# EAGLE design RS232_2xNPN_FTDI_PowerSel (EAGLE 7.7.0)
RS232 Adapter using two NPN Transistors
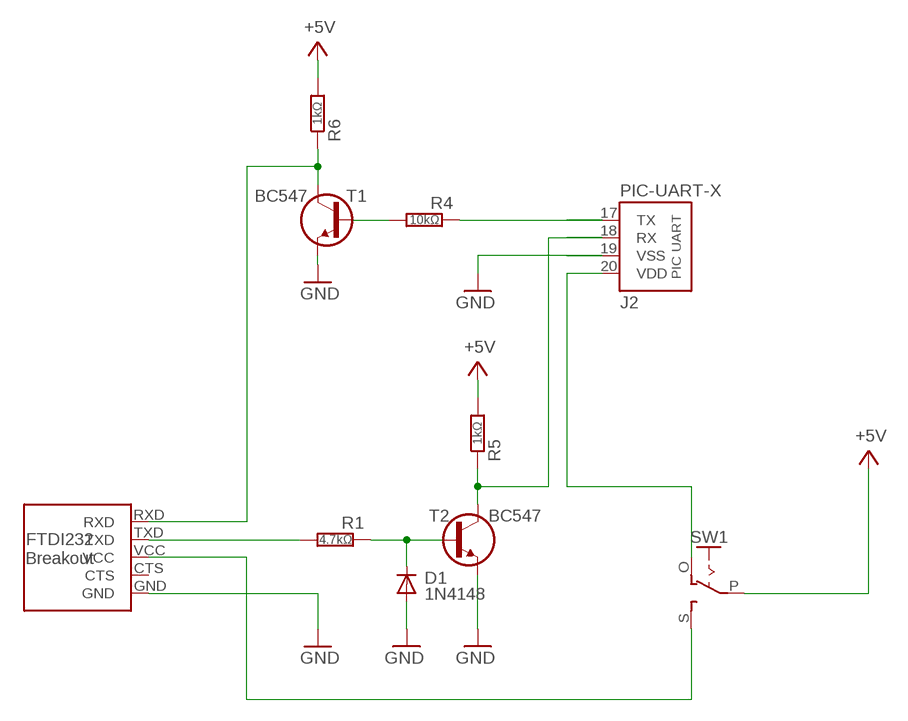
[diagram p0: schematic, sheet 1]

## Parts
D1  1N4148  1N414834-5V  [DO34-5V]
J1  FTDI232-BO-5P-L  [FTDI232-BO-5-L]
J2  PIC-UART-X  [PIC-UART-X]
R1  4.7kΩ  R0202/7  [0202/7]
R4  10kΩ  R0202/7  [0202/7]
R5  1kΩ  R0202/7-V  [0202/7-V]
R6  1kΩ  R0202/7  [0202/7]
SW1  SL-SW-1P-2T-JPSW  [JPSW-1P2T]
T1  BC547  BC547CBE  [TO92-CBE]
T2  BC547  BC547CBE  [TO92-CBE]

## Nets
+5V: R5.2 R6.2 SW1.P
GND: D1.A J1.GND J2.19(VSS) T1.E T2.E
N$1: J2.18(RX) R5.1 T2.C
N$2: D1.C R1.1 T2.B
N$3: J1.TXD R1.2
N$4: J2.17(TX) R4.1
N$5: R4.2 T1.B
N$6: J2.20(VDD) SW1.O
N$8: J1.VCC SW1.S
N$9: J1.RXD R6.1 T1.C
Unconnected: J1.CTS

## Library data of the parts
D1 = d:1N4148
J1 = pinconn:FTDI232-BO-5P
J2 = pinconn:PIC-UART
R1 R4-R6 = r:R: RESISTOR, European symbol
SW1 = sw:SL-SW-1P-2T
T1 T2 = t:BC547

## Net classes
0 default: width 0.813 mm

## Board
RS232 Adapter using two NPN Transistors
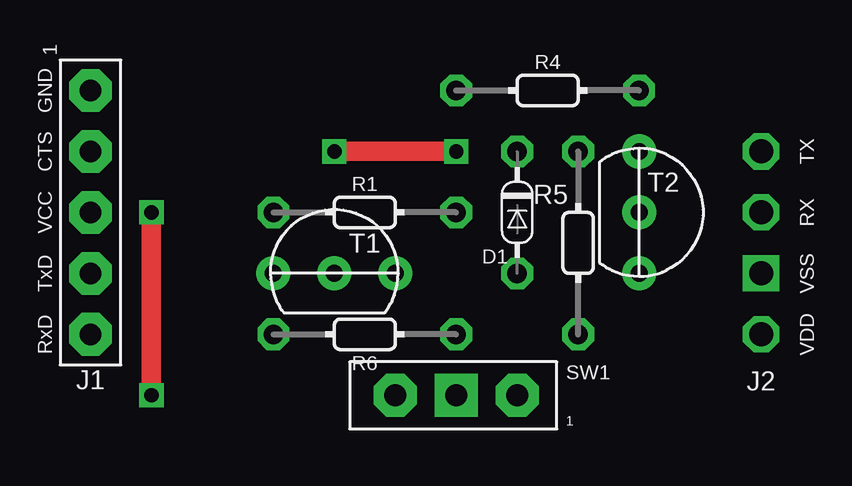
[diagram p1: board, top side]
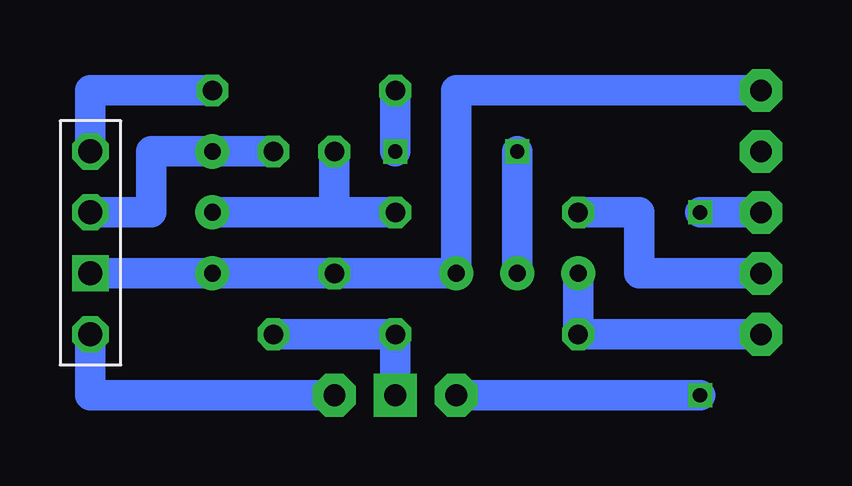
[diagram p2: board, bottom side, seen from below]

No outline drawn. Coordinates in mm, seen from the top.
Copper layers (1*16): Top 0.035mm / dielectric 1.5mm / Bottom 0.035mm
Design rules "default": minimum track width 10mil, minimum drill 24mil, track to track 8mil, track to pad 8mil, pad to pad 8mil, via to via 8mil, smd to smd 8mil, copper to edge 40mil, drill to drill 8mil, minimum pad ring 10mil, minimum via ring 8mil, stop-mask expansion 4mil, vias tented up to drill 0mil, thermal gap 10mil

### Footprints (pad centres in the part's own frame; a part is rotated, then mirrored left to right if it is on the bottom)
DO34-5V = drill 0.813 octagon: A 0,2.54; C 0,-2.54
FTDI232-BO-5-L = drill 0.9 pad 1.778 octagon: CTS 0,2.54; GND 0,5.08; RXD 0,-5.08; TXD 0,-2.54; VCC 0,0
PIC-UART-X = drill 1 octagon: 17 0,-3.81; 18 0,-1.27; 20 0,3.81 | drill 1 square: 19 0,1.27
0202/7 = drill 0.813 octagon: 1 -3.81,0; 2 3.81,0
0202/7-V = drill 0.813 octagon: 1 0,-3.81; 2 0,3.81
JPSW-1P2T = drill 0.9 pad 1.778 octagon: O -2.54,0; S 2.54,0 | drill 0.9 pad 1.778 square: P 0,0
TO92-CBE = drill 0.7 pad 1.422: B 0,0; C 0,2.54; E 0,-2.54

### Placement (x,y rotation side)
D1  17.78,7.62 180 top
J1  0,7.62 0 top
J2  27.94,6.35 180 top
R1  11.43,7.62 180 top
R4  19.05,12.7 180 top
R5  20.32,6.35 180 top
R6  11.43,2.54 0 top
SW1  15.24,0 180 top
T1  10.16,5.08 90 top
T2  22.86,7.62 0 top

### Tracks (layer width: path | path; a pad name or v marks a point on that pad's centre or on a via)
+5V
  Bottom 1.27: R5.2 R6.2 SW1.P
GND
  Bottom 1.27: J2.19 T2.E D1.A T1.E 12.7,12.7 J1.GND
N$1
  Bottom 1.27: R5.1 T2.C 25.4,10.16 25.4,7.62 J2.18
N$2
  Bottom 1.27: T2.B R1.1 17.78,7.62 D1.C
N$3
  Bottom 1.27: J1.TXD 5.08,5.08 5.08,7.62 R1.2
N$4
  Bottom 1.27: R4.1 27.94,12.7 J2.17
N$5  (via drill 0.6)
  Top 0.813: v10.16,10.16 v15.24,10.16
  Bottom 1.27: T1.B v10.16,10.16 | v15.24,10.16 R4.2
N$6
  Bottom 1.27: J2.20 27.94,0 SW1.O
N$8  (via drill 0.6)
  Top 0.813: v2.54,7.62 v2.54,0
  Bottom 1.27: J1.VCC v2.54,7.62 | v2.54,0 SW1.S
N$9
  Bottom 1.27: T1.C R6.1 J1.RXD